# EAGLE design gps_fe_v5 (EAGLE 7.5.0)
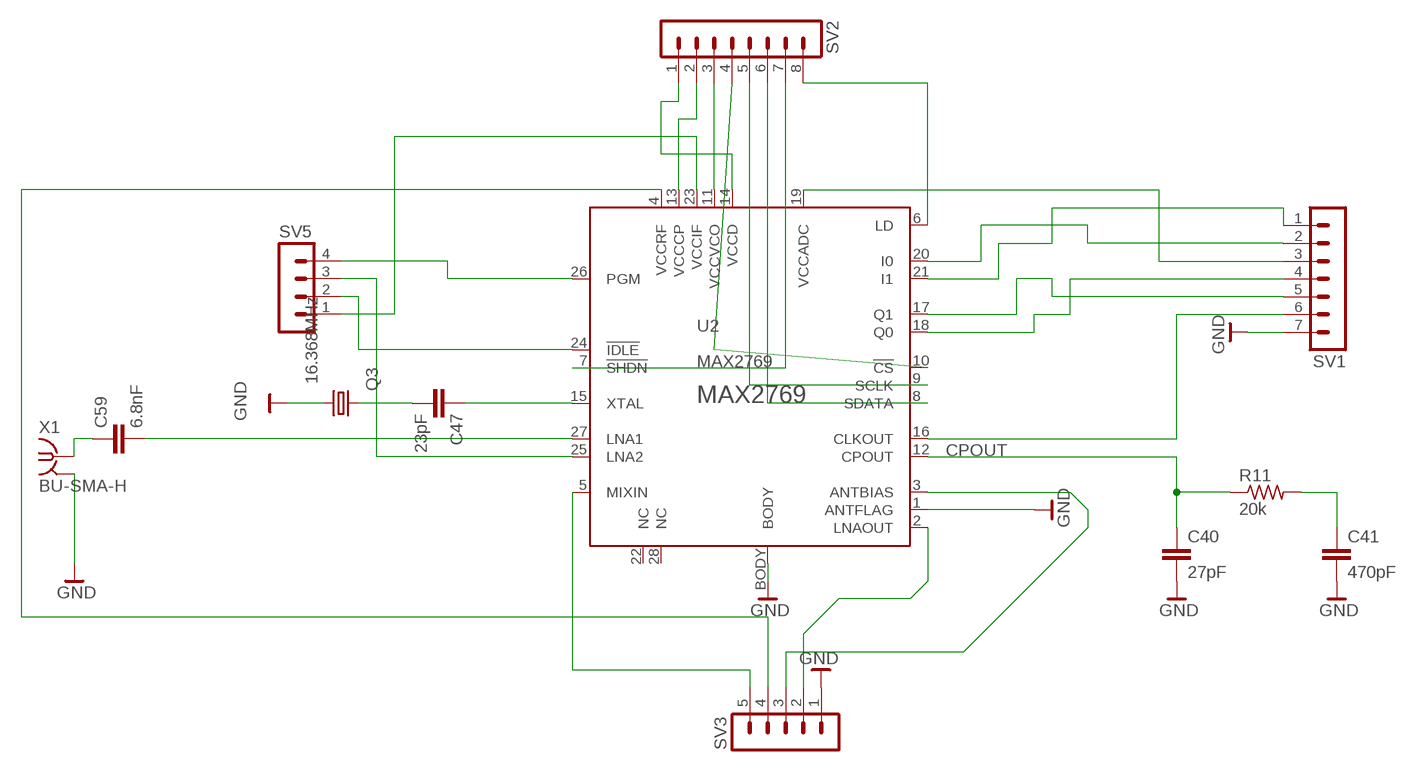
[diagram p0: schematic, sheet 1]

## Parts
C40  27pF  C-EUC0402  [C0402]
C41  470pF  C-EUC0402  [C0402]
C47  23pF  C-EUC0402  [C0402]
C59  6.8nF  C-EUC0402  [C0402]
Q3  16.368MHz  CRYSTALCTS406  [CTS406]
R11  20k  R-US_R0402  [R0402]
SV1  MA07-1  [MA07-1]
SV2  MA08-1  [MA08-1]
SV3  MA05-1  [MA05-1]
SV5  MA04-1  [MA04-1]
U2  MAX2769  [90-0023]
X1  BU-SMA-H  [BU-SMA-H]

## Nets
BAR_GND: C40.2 C41.2 Q3.3 SV1.7 SV3.1 U2.1(ANTFLAG) U2.BODY X1.2(GND) ; supply symbol labelled GND
CPOUT: C40.1 R11.1 U2.12(CPOUT)
LNA3: C59.2 U2.27(LNA1)
N$1: SV1.5 U2.17(Q1)
N$2: C41.1 R11.2
N$3: SV1.4 U2.18(Q0)
N$4: SV1.1 U2.21(I1)
N$5: SV1.2 U2.20(I0)
N$6: SV2.4 U2.10(!CS)
N$7: SV2.5 U2.9(SCLK)
N$8: SV2.6 U2.8(SDATA)
N$9: SV2.7 U2.7(!SHDN)
N$10: SV2.8 U2.6(LD)
N$11: SV1.6 U2.16(CLKOUT)
N$12: SV1.3 U2.19(VCCADC)
N$13: SV5.2 U2.24(!IDLE)
N$14: C47.2 Q3.1
N$15: C59.1 X1.1
N$16: SV5.4 U2.26(PGM)
N$17: SV3.2 U2.2(LNAOUT)
N$18: SV3.3 U2.3(ANTBIAS)
N$19: SV3.4 U2.4(VCCRF)
N$20: C47.1 U2.15(XTAL)
N$21: SV3.5 U2.5(MIXIN)
N$22: SV5.1 U2.23(VCCIF)
N$23: SV2.3 U2.11(VCCVCO)
N$24: SV2.2 U2.13(VCCCP)
N$25: SV5.3 U2.25(LNA2)
N$26: SV2.1 U2.14(VCCD)
Unconnected: U2.22(NC) U2.28(NC)

## Power pins joined to a net without a drawn wire
GND: X1.3(GND) X1.4(GND) X1.5(GND)

## Library data of the parts
C40 C41 C47 C59 = rcl:C-EU: CAPACITOR, European symbol
Q3 = crystal:CRYSTAL: CRYSTAL; OC_FARNELL: unknown; OC_NEWARK: unknown
R11 = rcl:R-US_: RESISTOR, American symbol
SV1 = con-lstb:MA07-1: PIN HEADER; OC_FARNELL: unknown; OC_NEWARK: unknown
SV2 = con-lstb:MA08-1: PIN HEADER; OC_FARNELL: unknown; OC_NEWARK: unknown
SV3 = con-lstb:MA05-1: PIN HEADER; OC_FARNELL: unknown; OC_NEWARK: unknown
SV5 = con-lstb:MA04-1: PIN HEADER; OC_FARNELL: unknown; OC_NEWARK: unknown
U2 = wicker:MAX2769: MAX2769 Universal GPS Receiver IC Package Land Pattern [T2855-3/T2855-3+] http://pdfserv.maxim-ic.com/land_patterns/90-0023.PDF Thin Quad Flatpack, No Leads http://pdfserv.maxim-ic.com/package_dwgs/21-0140.PDF Related Datasheet http://www.maxim-ic.com/datasheet/index.mvp/id/5241
X1 = con-coax:BU-SMA-H: FEMALE SMA CONNECTOR Radiall; OC_FARNELL: unknown; OC_NEWARK: unknown

## Board
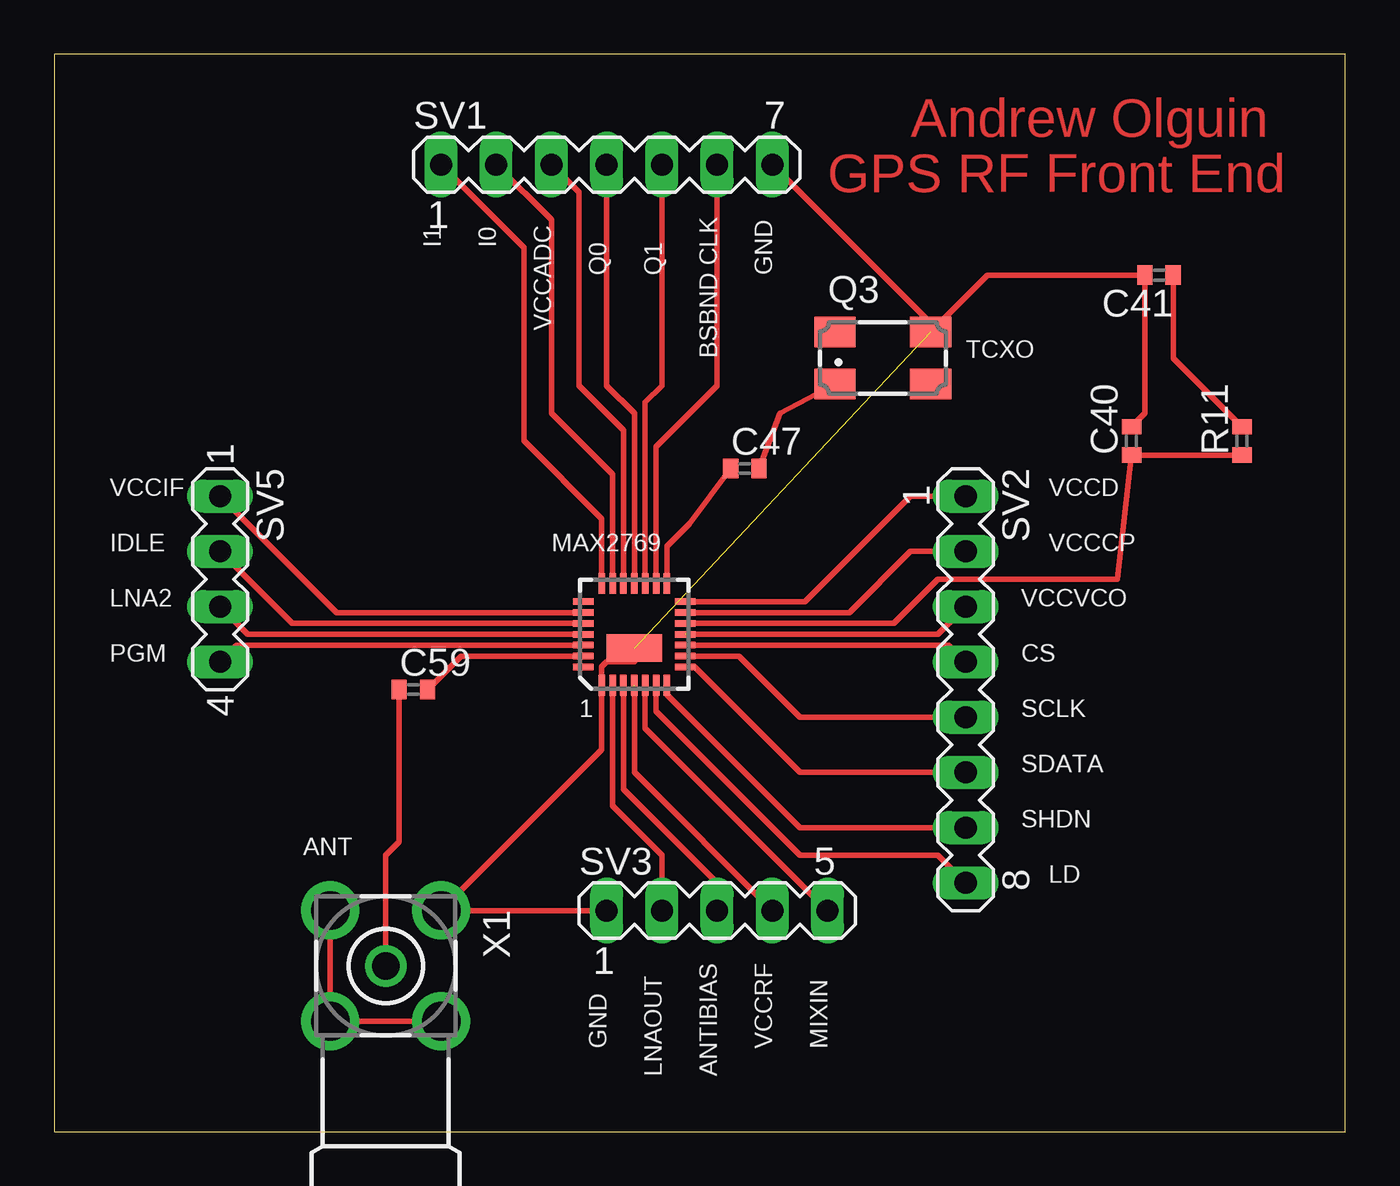
[diagram p1: board, top side]

Size 59.36 x 49.52 mm. Coordinates in mm from the lower left corner, seen from the top.
Outline: 0,0 59.36,0 59.36,49.52 0,49.52 0,0
Copper layers (1*16): Top 0.035mm / dielectric 1.5mm / Bottom 0.035mm
Design rules "default": minimum track width 10mil, minimum drill 24mil, track to track 8mil, track to pad 8mil, pad to pad 8mil, via to via 8mil, smd to smd 8mil, copper to edge 40mil, drill to drill 8mil, minimum pad ring 10mil, minimum via ring 8mil, stop-mask expansion 4mil, vias tented up to drill 0mil, thermal gap 10mil

### Footprints (pad centres in the part's own frame; a part is rotated, then mirrored left to right if it is on the bottom)
C0402 = smd 0.7 x 0.9: 1 -0.65,0; 2 0.65,0
CTS406 = smd 1.9 x 1.4: 1 -2.2,-1.2; 2 2.2,-1.2; 3 2.2,1.2; 4 -2.2,1.2
R0402 = smd 0.7 x 0.9: 1 -0.65,0; 2 0.65,0
MA07-1 = drill 1.016 long: 1 -7.62,0; 2 -5.08,0; 3 -2.54,0; 4 0,0; 5 2.54,0; 6 5.08,0; 7 7.62,0
MA08-1 = drill 1.016 long: 1 -8.89,0; 2 -6.35,0; 3 -3.81,0; 4 -1.27,0; 5 1.27,0; 6 3.81,0; 7 6.35,0; 8 8.89,0
MA05-1 = drill 1.016 long: 1 -5.08,0; 2 -2.54,0; 3 0,0; 4 2.54,0; 5 5.08,0
MA04-1 = drill 1.016 long: 1 -3.81,0; 2 -1.27,0; 3 1.27,0; 4 3.81,0
90-0023 = smd 0.3 x 0.95: 1 -1.5,-2.34; 2 -1,-2.34; 3 -0.5,-2.34; 4 0,-2.34; 5 0.5,-2.34; 6 1,-2.34; 7 1.5,-2.34; 15 1.5,2.34; 16 1,2.34; 17 0.5,2.34; 18 0,2.34; 19 -0.5,2.34; 20 -1,2.34; 21 -1.5,2.34 | smd 0.95 x 0.3: 8 2.34,-1.5; 9 2.34,-1; 10 2.34,-0.5; 11 2.34,0; 12 2.34,0.5; 13 2.34,1; 14 2.34,1.5; 22 -2.34,1.5; 23 -2.34,1; 24 -2.34,0.5; 25 -2.34,0; 26 -2.34,-0.5; 27 -2.34,-1; 28 -2.34,-1.5 | smd 2.54 x 1.27: BODY 0,-0.635
BU-SMA-H = drill 1.27: 1 0,0 | drill 1.778: 2 -2.55,2.55; 3 2.55,2.55; 4 2.55,-2.55; 5 -2.55,-2.55

### Placement (x,y rotation side)
C40  49.53,31.75 90 top
C41  50.8,39.37 180 top
C47  31.75,30.48 0 top
C59  16.51,20.32 0 top
Q3  38.1,35.56 0 top
R11  54.61,31.75 90 top
SV1  25.4,44.45 0 top
SV2  41.91,20.32 270 top
SV3  30.48,10.16 0 top
SV5  7.62,25.4 270 top
U2  26.67,22.86 0 top
X1  15.24,7.62 270 top

### Tracks (layer width: path | path; a pad name or v marks a point on that pad's centre or on a via)
BAR_GND  (1 unrouted)
  Top 0.254: SV1.7 40.3,37.17 Q3.3 42.91,39.37 C41.2 50.15,33.02 C40.2 | SV3.1 X1.2 25.17,17.55 U2.1 25.17,21.36 25.4,21.59 26.67,21.59 U2.BODY
CPOUT
  Top 0.254: U2.12 38.6,23.36 40.64,25.4 48.88,25.4 C40.1 R11.1
GND
  Top 0.254: X1.3 X1.4 X1.5
LNA3
  Top 0.254: C59.2 18.7,21.86 U2.27
N$1
  Top 0.254: SV1.5 27.94,34.29 27.17,33.52 U2.17
N$2
  Top 0.254: R11.2 51.45,35.56 C41.1
N$3
  Top 0.254: SV1.4 25.4,34.29 26.67,33.02 U2.18
N$4
  Top 0.254: SV1.1 21.59,40.64 21.59,31.75 25.17,28.17 U2.21
N$5
  Top 0.254: SV1.2 22.86,41.91 22.86,33.02 25.67,30.21 U2.20
N$6
  Top 0.254: SV2.4 41.14,22.36 U2.10
N$7
  Top 0.254: SV2.5 34.29,19.05 31.48,21.86 U2.9
N$8
  Top 0.254: SV2.6 34.29,16.51 29.44,21.36 U2.8
N$9
  Top 0.254: SV2.7 34.29,13.97 28.17,20.09 U2.7
N$10
  Top 0.254: SV2.8 40.64,12.7 34.29,12.7 27.67,19.32 U2.6
N$11
  Top 0.254: SV1.6 30.48,34.29 27.67,31.48 U2.16
N$12
  Top 0.254: SV1.3 24.13,43.18 24.13,34.29 26.17,32.25 U2.19
N$13
  Top 0.254: SV5.2 10.93,23.36 U2.24
N$14
  Top 0.254: C47.2 33.36,33.02 Q3.1
N$15
  Top 0.254: X1.1 15.24,12.7 15.86,13.32 C59.1
N$16
  Top 0.254: SV5.4 8.39,22.36 U2.26
N$17
  Top 0.254: SV3.2 27.94,12.7 25.67,14.97 U2.2
N$18
  Top 0.254: SV3.3 30.48,11.43 26.17,15.74 U2.3
N$19  (1 unrouted)
  Top 0.254: SV3.4 26.67,16.51 26.67,20.32
N$20
  Top 0.254: C47.1 29.21,27.94 28.17,26.9 U2.15
N$21
  Top 0.254: SV3.5 27.17,18.55 U2.5
N$22
  Top 0.254: SV5.1 12.97,23.86 U2.23
N$23  (1 unrouted)
  Top 0.254: SV2.3 40.64,22.86 29.21,22.86
N$24
  Top 0.254: SV2.2 39.37,26.67 36.56,23.86 U2.13
N$25
  Top 0.254: SV5.3 8.89,22.86 U2.25
N$26
  Top 0.254: SV2.1 39.37,29.21 34.52,24.36 U2.14

### Text on the board
Top: Andrew Olguin | GPS RF Front End
tNames: I1 | I0 | Q0 | Q1 | GND | VCCADC | BSBND CLK | TCXO | VCCIF | VCCD | IDLE | MAX2769 | VCCCP | LNA2 | VCCVCO | PGM | CS | 1 | SCLK | SDATA | SHDN | ANT | LD | GND | VCCRF | MIXIN | LNAOUT | ANTIBIAS